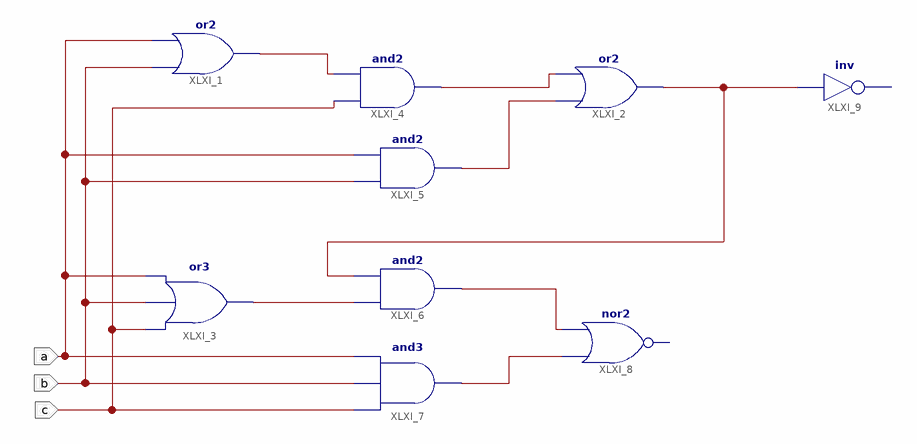
[diagram p0: schematic sheet 1]
// Xilinx ISE schematic fulladd.sch (spartan6) as structural Verilog: 9 symbols, 3 ports
module fulladd (
  input  c,
  input  b,
  input  a
);

  wire XLXN_1, XLXN_2, XLXN_4, XLXN_6, XLXN_7, XLXN_8, XLXN_13;

  or XLXI_1 (XLXN_1, b, a);
  or XLXI_2 (XLXN_6, XLXN_4, XLXN_2);
  or XLXI_3 (XLXN_8, c, b, a);
  and XLXI_4 (XLXN_2, c, XLXN_1);
  and XLXI_5 (XLXN_4, b, a);
  and XLXI_6 (XLXN_7, XLXN_8, XLXN_6);
  and XLXI_7 (XLXN_13, c, b, a);
  // nor2 XLXI_8 has open pins: I0=XLXN_13, I1=XLXN_7, O=open
  // inv XLXI_9 has open pins: I=XLXN_6, O=open
endmodule
